# Altium schematic sheet Force_Plates_Power_Supply.SchDoc
size OrCAD A; Organization: Altium Limited; Address1: L3, 12a Rodborough Rd; Address2: Frenchs Forest; Address3: NSW; Address4: Australia 2086
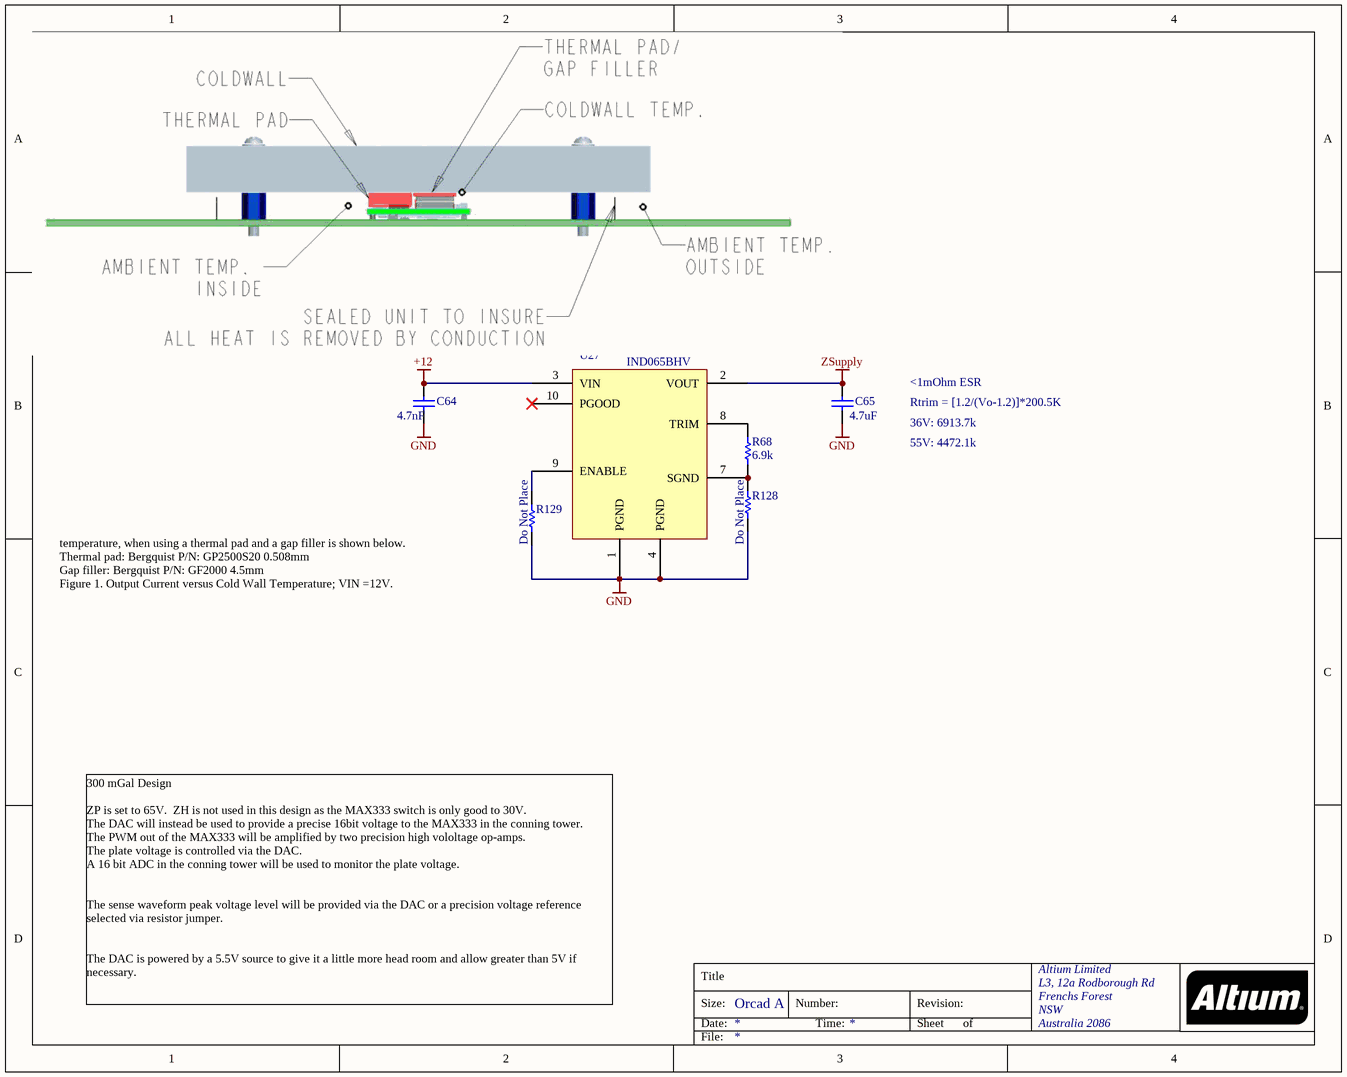
[diagram p0: Force_Plates_Power_Supply.SchDoc]

## Parts
C64  Capacitance: 4.7nF  [CAPC0805(2012)155_L]  (hidden comment: C1206C472K1RECAUTO)
C65  Capacitance: 4.7uF  [CAPC1210(3225)130_M]  (hidden comment: C1206C472K1RECAUTO)
R68  6.9k  [RESC0805(2012)_L]
R128  Do Not Place  [RESC0805(2012)_L]
R129  Do Not Place  [RESC0805(2012)_L]
U27  IND065BHV  [IND065BHV]

## Nets
+12: C64.2 U27.3(VIN)
GND: C64.1 C65.1 R128.2 R129.2 U27.1(PGND) U27.4(PGND)
ZSupply: C65.2 U27.2(VOUT)
NetR68_1: R68.1 U27.8(TRIM)
NetR68_2: R68.2 R128.1 U27.7(SGND)
NetR129_1: R129.1 U27.9(ENABLE)

Not connected (* = marked no-connect by the designer): U27 10(PGOOD)*

## Notes on the sheet
- <1mOhm ESR
- Rtrim = [1.2/(Vo-1.2)]*200.5K
- 36V: 6913.7k
- 55V: 4472.1k
- temperature, when using a thermal pad and a gap filler is shown below.
  Thermal pad: Bergquist P/N: GP2500S20 0.508mm
  Gap filler: Bergquist P/N: GF2000 4.5mm
  Figure 1. Output Current versus Cold Wall Temperature; VIN =12V.
- 300 mGal Design
  ZP is set to 65V.  ZH is not used in this design as the MAX333 switch is only good to 30V.
  The DAC will instead be used to provide a precise 16bit voltage to the MAX333 in the conning tower.
  The PWM out of the MAX333 will be amplified by two precision high vololtage op-amps.
  The plate voltage is controlled via the DAC.
  A 16 bit ADC in the conning tower will be used to monitor the plate voltage.
  The sense waveform peak voltage level will be provided via the DAC or a precision voltage reference selected via resistor jumper.
  The DAC is powered by a 5.5V source to give it a little more head room and allow greater than 5V if necessary.
- Title
- Size:
- Date:
- Orcad A
- Number:
- Time:
- Revision:
- Sheet
- of
- File:

## Library data of the parts
C64 = CMP-1036-04882-1: 4700pF ±10% 100V Ceramic Capacitor X7R 1206 (3216 Metric); Manufacturer: KEMET; Dielectric Material: Tantalum; Voltage Rating (DC): 25V; Supplier 1: Digi-Key; Supplier Part Number 1: 399-17897-1-ND; Manufacturer Part Number: C1206C472K1RECAUTO; Stock 1: 11581; Pricing 1: 1=0.27000, 10=0.18700, 100=0.10610, 500=0.07490, 1000=0.06554 (USD); RoHS: No; ComponentLink1URL: https://api.kemet.com/component-edge/download/datasheet/C1206C472K1RECAUTO.pdf?src-supplier=Digi-Key; ComponentLink1Description: https://api.kemet.com/component-edge/download/datasheet/C1206C472K1RECAUTO.pdf?src-supplier=Digi-Key; Supplier 2: Mouser; Supplier Part Number 2: 77-VJ0805Y472KXXCBC; Stock 2: 549; Pricing 2: 1=0.44000, 10=0.44000, 50=0.35100, 100=0.26700, 1000=0.10100, 10000=0.04500 (USD); Mount: Surface Mount; Case/Package: 0805; Case Code (Imperial): 0805; Case Code (Metric): 2012; Min Operating Temperature: -55°C; Max Operating Temperature: 125°C; Tolerance: 10%; Packaging: Tape and Reel; Termination: SMD/SMT; Package Quantity: 4000; Dielectric: X7R; Length: 2mm; Height: 1.45mm; Width: 1.25mm; Depth: 1.25mm; Lead Free: Lead Free; ComponentLink2URL: https://datasheet.ciiva.com/11495/vjw1bcbascomseries-11495305.pdf?src-supplier=Avnet; ComponentLink2Description: https://datasheet.ciiva.com/11495/vjw1bcbascomseries-11495305.pdf?src-supplier=Avnet
C65 = CMP-1038-00936-1: 4700pF ±10% 100V Ceramic Capacitor X7R 1206 (3216 Metric); Manufacturer: KEMET; ComponentLink1URL: https://datasheet.ciiva.com/193/kem-c1015-x7r-ff-cap-smd-193189.pdf?src-supplier=Digi-Key; ComponentLink1Description: https://datasheet.ciiva.com/193/kem-c1015-x7r-ff-cap-smd-193189.pdf?src-supplier=Digi-Key; ComponentLink2URL: https://datasheet.ciiva.com/7807/6129-7807311.pdf?src-supplier=Element14; ComponentLink2Description: https://datasheet.ciiva.com/7807/6129-7807311.pdf?src-supplier=Element14; ComponentLink3URL: http://www.mouser.com/ds/2/212/KEM_C1013_X7R_FT-CAP_SMD-346914.pdf?src-supplier=Mouser; ComponentLink3Description: http://www.mouser.com/ds/2/212/KEM_C1013_X7R_FT-CAP_SMD-346914.pdf?src-supplier=Mouser; Supplier 1: Digi-Key; Supplier Part Number 1: 399-17897-1-ND; Manufacturer Part Number: C1206C472K1RECAUTO; Stock 1: 11581; Pricing 1: 1=0.27000, 10=0.18700, 100=0.10610, 500=0.07490, 1000=0.06554 (USD); RoHS: No; ComponentLink4URL: https://api.kemet.com/component-edge/download/datasheet/C1206C472K1RECAUTO.pdf?src-supplier=Digi-Key; ComponentLink4Description: https://api.kemet.com/component-edge/download/datasheet/C1206C472K1RECAUTO.pdf?src-supplier=Digi-Key
R68 = CMP-1013-00215-1: 6.9 kOhms ±0.1% 0.1W,0805; Manufacturer: Vishay Dale; Manufacturer Part Number: CRCW080510K0FKEA; Tolerance: ±1%; Power (Watts): 0.125W, 1/8W; Temperature Coefficient: ±100ppm/°C; Supplier 1: Digi-Key; Supplier Part Number 1: 541-10.0KCCT-ND; RoHS: RoHS Compliant; Category: Resistors; Stock 1: 1104982; Pricing 1: 1=0.1, 10=0.055, 100=0.0223, 1000=0.01003, 2500=0.0087 (USD); Packaging: Cut Tape (CT); Part Status: Active; Composition: Thick Film; Features: Automotive AEC-Q200; Operating Temperature: -55°C ~ 155°C; Package / Case: 0805 (2012 Metric); Supplier Device Package: 0805; Size / Dimension: 0.079" L x 0.049" W (2.00mm x 1.25mm); Height - Seated (Max): 0.020" (0.50mm); Failure Rate: -; ComponentLink1URL: http://www.vishay.com/docs/20035/dcrcwe3.pdf; ComponentLink1Description: http://www.vishay.com/docs/20035/dcrcwe3.pdf
R128 R129 = CMP-1013-00215-1: 0 Ohms ±0.1% 0.1W,0805; Manufacturer: Vishay Dale; Manufacturer Part Number: CRCW080510K0FKEA; Tolerance: ±1%; Power (Watts): 0.125W, 1/8W; Temperature Coefficient: ±100ppm/°C; Supplier 1: Digi-Key; Supplier Part Number 1: 541-10.0KCCT-ND; RoHS: RoHS Compliant; Category: Resistors; Stock 1: 1104982; Pricing 1: 1=0.1, 10=0.055, 100=0.0223, 1000=0.01003, 2500=0.0087 (USD); Packaging: Cut Tape (CT); Part Status: Active; Composition: Thick Film; Features: Automotive AEC-Q200; Operating Temperature: -55°C ~ 155°C; Package / Case: 0805 (2012 Metric); Supplier Device Package: 0805; Size / Dimension: 0.079" L x 0.049" W (2.00mm x 1.25mm); Height - Seated (Max): 0.020" (0.50mm); Failure Rate: -; ComponentLink1URL: http://www.vishay.com/docs/20035/dcrcwe3.pdf; ComponentLink1Description: http://www.vishay.com/docs/20035/dcrcwe3.pdf
U27 = IND065BHV: Non-Isolated PoL Module DC DC Converter 1 Output 32 ~ 54V 2A 9.6V - 14.4V Input